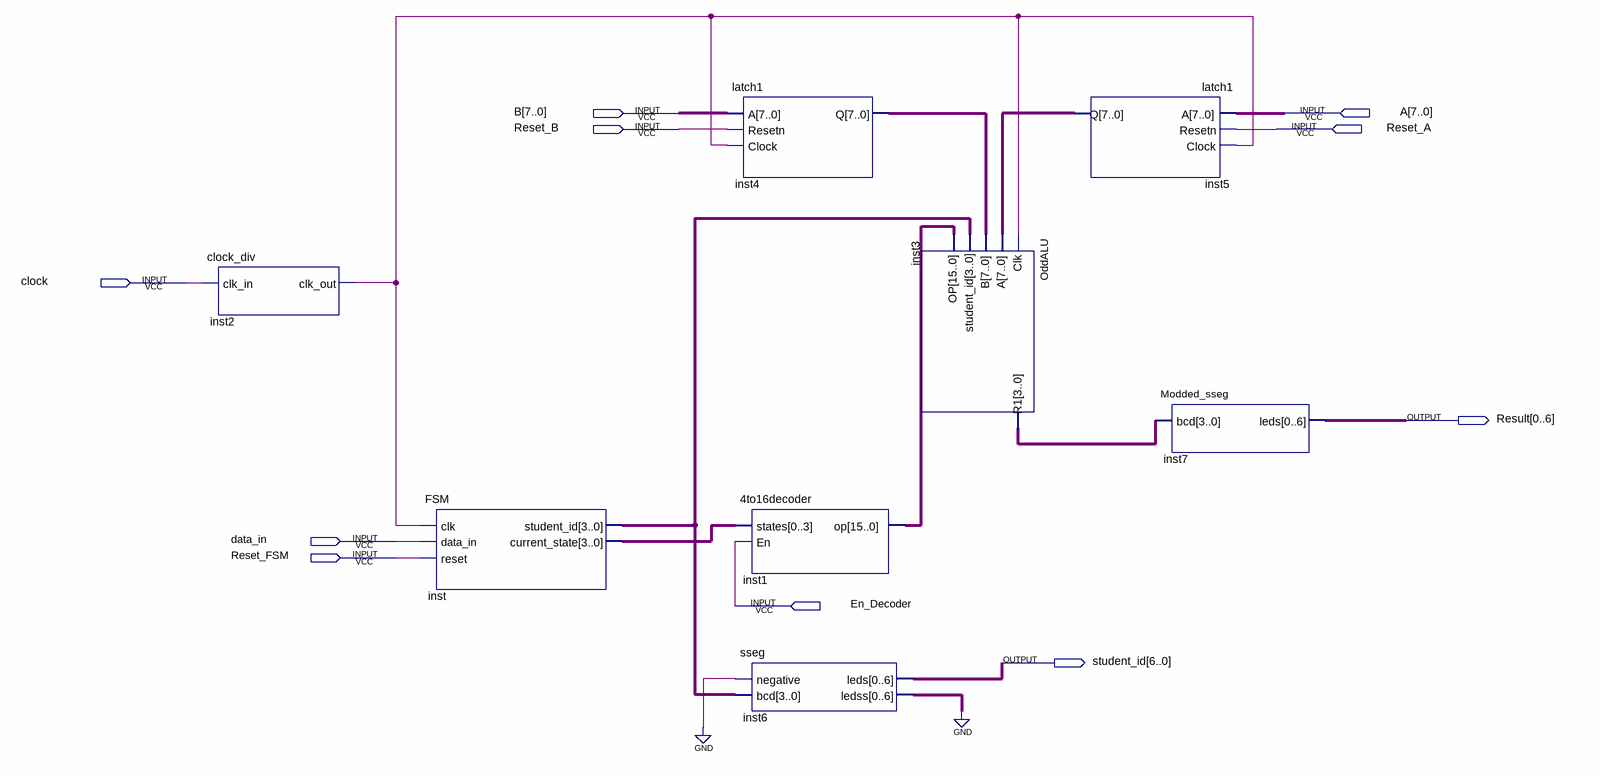
[diagram p0: schematic sheet]
// Quartus schematic problem3.bdf as structural Verilog: 8 symbols, 10 pins
module problem3 (
  input  [7:0] B,
  input  [7:0] A,
  input  Reset_B,
  input  Reset_A,
  input  clock,
  input  data_in,
  input  Reset_FSM,
  input  En_Decoder,
  output [0:6] Result,
  output [6:0] student_id
);

  wire inst2_clk_out;
  wire [3:0] inst3_r1, inst_current_state, inst_student_id;
  wire [6:0] inst6_ledss;
  wire [7:0] inst4_q, inst5_q;
  wire [15:0] inst1_op;

  clock_div inst2 (.clk_in(clock), .clk_out(inst2_clk_out));
  FSM inst (
    .clk(inst2_clk_out), .data_in(data_in), .reset(Reset_FSM), .student_id(inst_student_id),
    .current_state(inst_current_state));
  latch1 inst4 (.A(B), .Resetn(Reset_B), .Clock(inst2_clk_out), .Q(inst4_q));
  \4to16decoder  inst1 (.states(inst_current_state), .En(En_Decoder), .op(inst1_op));
  sseg inst6 (.negative(1'b0), .bcd(inst_student_id), .leds(student_id), .ledss(inst6_ledss));
  OddALU inst3 (
    .Clk(inst2_clk_out), .A(inst5_q), .B(inst4_q), .student_id(inst_student_id), .OP(inst1_op), .R1(inst3_r1));
  latch1 inst5 (.A(A), .Resetn(Reset_A), .Clock(inst2_clk_out), .Q(inst5_q));
  Modded_sseg inst7 (.bcd(inst3_r1), .leds(Result));
  // also tied to GND on the sheet: {inst6_ledss[0], inst6_ledss[1], inst6_ledss[2], inst6_ledss[3], inst6_ledss[4], inst6_ledss[5], inst6_ledss[6]}
endmodule
